# EAGLE design IR_MB (EAGLE 9.2.2)
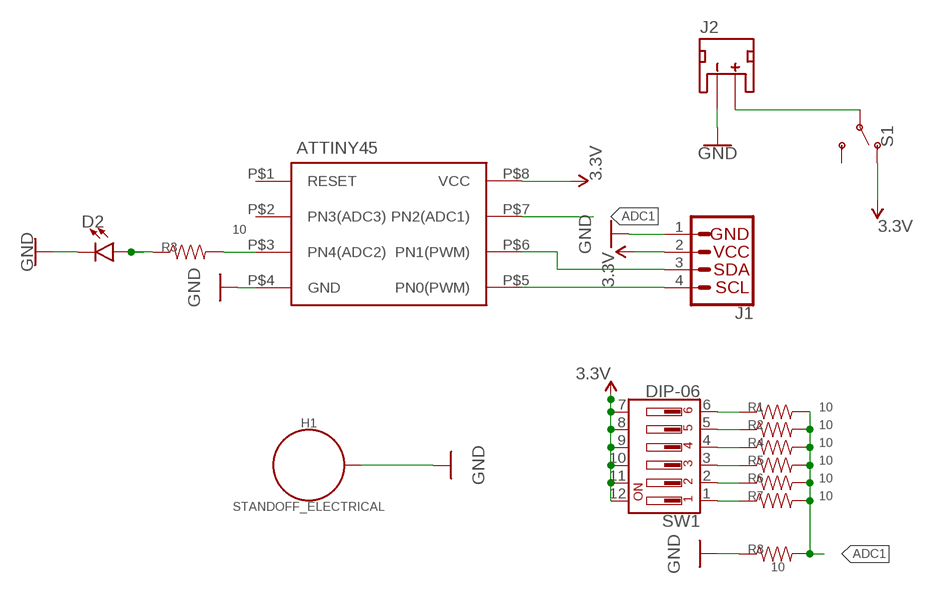
[diagram p0: schematic, sheet 1]

## Parts
D2  LED-FKIT-1206  [FKIT-LED-1206]
H1  STANDOFF_ELECTRICAL  [STANDOFF-ELECTRICAL]
J1  QWIIC_CONNECTORJS-1MM  [1X04_1MM_RA]
J2  JST_2MM_MALE  [JST-2-SMD]
R1  10  10OHM-1206-1/4W-1%  [1206]
R2  10  10OHM-1206-1/4W-1%  [1206]
R3  10  10OHM-1206-1/4W-1%  [1206]
R4  10  10OHM-1206-1/4W-1%  [1206]
R5  10  10OHM-1206-1/4W-1%  [1206]
R6  10  10OHM-1206-1/4W-1%  [1206]
R7  10  10OHM-1206-1/4W-1%  [1206]
R8  10  10OHM-1206-1/4W-1%  [1206]
S1  SWITCH-SPDT-PTH-11.6X4.0MM-KIT  [SWITCH_SPDT_PTH_11.6X4.0MM_KIT]
SW1  DIP-06  [DIPSWITCH-06-SMD]
U$1  ATTINY45  [8PDIP]

## Nets
3.3V [5v]: J1.2 S1.1(O) SW1.7 SW1.8 SW1.9 SW1.10 SW1.11 SW1.12 U$1.P$8(VCC)
ADC1: R1.2 R2.2 R4.2 R5.2 R6.2 R7.2 R8.2 U$1.P$7(PN2(ADC1))
GND: D2.C H1.P1 J1.1 J2.1(-) R8.1 U$1.P$4(GND)
N$1 [5v]: R3.2 U$1.P$3(PN4(ADC2))
N$2: D2.A R3.1
N$3: J1.4 U$1.P$5(PN0(PWM))
N$4: J1.3 U$1.P$6(PN1(PWM))
N$5: J2.2(+) S1.2(P)
N$6: R1.1 SW1.6
N$7: R2.1 SW1.5
N$8: R4.1 SW1.4
N$9: R5.1 SW1.3
N$10: R6.1 SW1.2
N$11: R7.1 SW1.1
Unconnected: J2.NC1(PAD1) J2.NC2(PAD2) S1.3(S) U$1.P$1(RESET) U$1.P$2(PN3(ADC3))

## Library data of the parts
D2 = SparkFun-LED:LED: LED (Generic) Standard schematic elements and footprints for 5mm, 3mm, 1206, and 0603 sized LEDs. Generic LEDs with no color specified.
H1 = IAD-Library:STANDOFF_ELECTRICAL: Stand Off Drill holes with an electrical connection to ground your board to a chassis.
J1 = SparkFun-Connectors:QWIIC_CONNECTOR: SparkFun I2C Standard Qwiic Connector An SMD 1mm pitch JST connector makes it easy and quick (get it? Qwiic?) to connect I2C devices to each other. The Qwiic system <http://www.sparkfun.com/qwiic> enables fast and solderless connection between popular platforms and various sensors and actuators. We carry 200mm <https://www.sparkfun.com/products/14204>, 100mm <https://www.sparkfun.com/products/14205>, 50mm <https://www.sparkfun.com/products/14206>, and breadboard friendly <https://www.sparkfun.com/products/14207> Qwiic cables. We also offer 10 pcs strips <https://www.sparkfun.com/products/14323> the SMD connectors.; PROD_ID: CONN-13694
J2 = SparkFun-Connectors:JST_2MM_MALE: JST 2MM MALE RA CONNECTOR Two pin, compact surface mount connector. Commonly used as a battery input connection point. We really like the solid locking feeling and high current rating on these small connectors. We use these all the time as battery connectors. Mates to single-cell LiPo batteries. Here is the connector we sell at SparkFun: JST Right Angle Connector - White <https://www.sparkfun.com/products/8612> (PRT-08612) Datasheet <http://www.sparkfun.com/datasheets/Prototyping/Connectors/JST-Horizontal.pdf> It was used on these SparkFun products: SparkFun MOSFET Power Controller <https://www.sparkfun.com/products/11214> (PRT-11214) SparkFun Battery Babysitter - LiPo Battery Manager <https://www.sparkfun.com/products/13777> (PRT-13777) And many, many others that required a lipo battery connection.; PROD_ID: CONN-11443; SF_ID: PRT-08612
R1-R8 = SparkFun-Resistors:10OHM: 10Ω resistor A resistor is a passive two-terminal electrical component that implements electrical resistance as a circuit element. Resistors act to reduce current flow, and, at the same time, act to lower voltage levels within circuits. - Wikipedia; PROD_ID: RES-08705
S1 = SparkFun-Switches:SWITCH-SPDT: Single Pole, Double Throw (SPDT) Switch Single-pole, double-throw (SPDT) switch. Variant Overview SMD-AYZ0202 Surface Mount DPDT Switch <https://www.sparkfun.com/products/597> (COM-00597) Used on e.g. LilyPad Arduino USB - ATmega32U4 Board <https://www.sparkfun.com/products/12049> PTH-11.6X4.0MM SPDT Mini Power Switch <https://www.sparkfun.com/products/102> (COM-00102) Used on e.g. SparkFun Simon Says - Through-Hole Soldering Kit <https://www.sparkfun.com/products/10547> (KIT-10547) PTH-11.6X4.0MM-KIT KIT version of SPDT Mini Power Switch - Simplifies soldering by removing tStop of switch pins - only one side can be soldered. PTH-11.6X4.0MM-LOCK LOCK version of SPDT Mini Power Switch - Offset pins hold switch in place for easier soldering. SMD-RIGHT-ANGLE Surface Mount Right Angle Switch <https://www.sparkfun.com/products/10860> (COM-10860) Used on e.g. SparkFun ESP8266 Thing <https://www.sparkfun.com/products/13231>; PROD_ID: SWCH-08261; SF_SKU: COM-00102
SW1 = SparkFun-Switches:DIP-06; PROD_ID: --------
U$1 = IAD-Library:ATTINY45: Attiny 45 or 85

## Net classes
0 default: width 0.4 mm, clearance 0.2 mm
1 5v: width 0.6 mm, clearance 0.2 mm

## Board
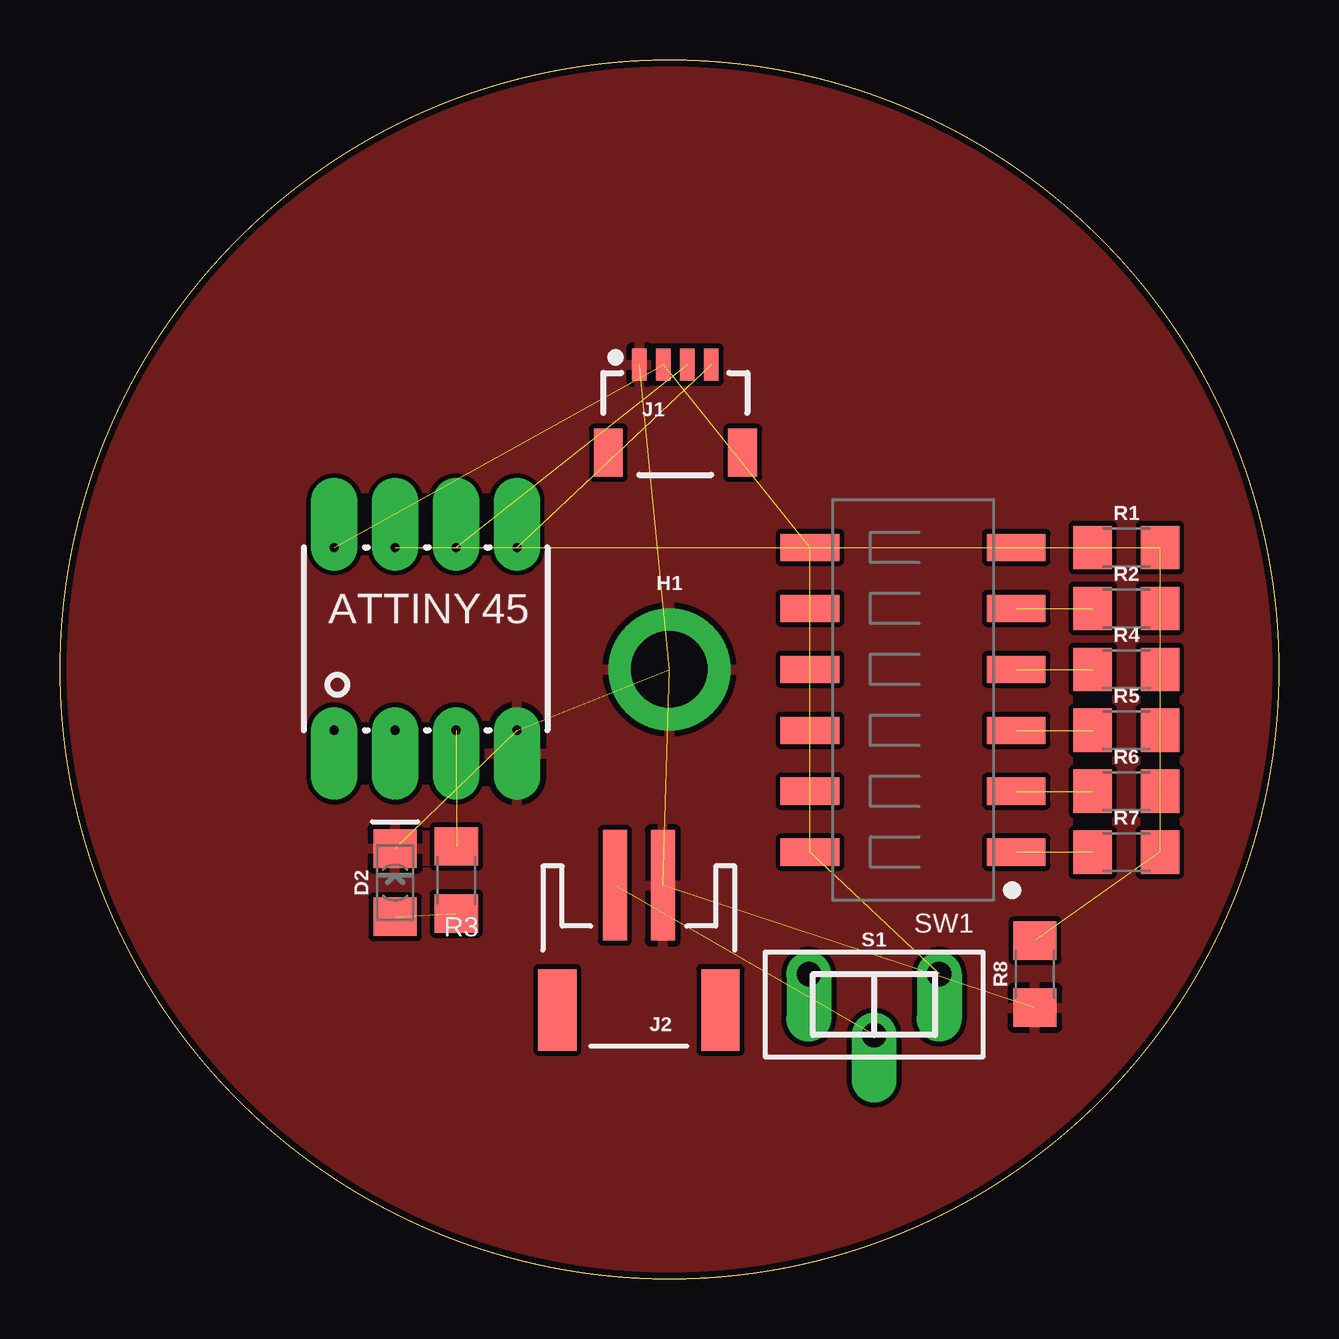
[diagram p1: board, top side]
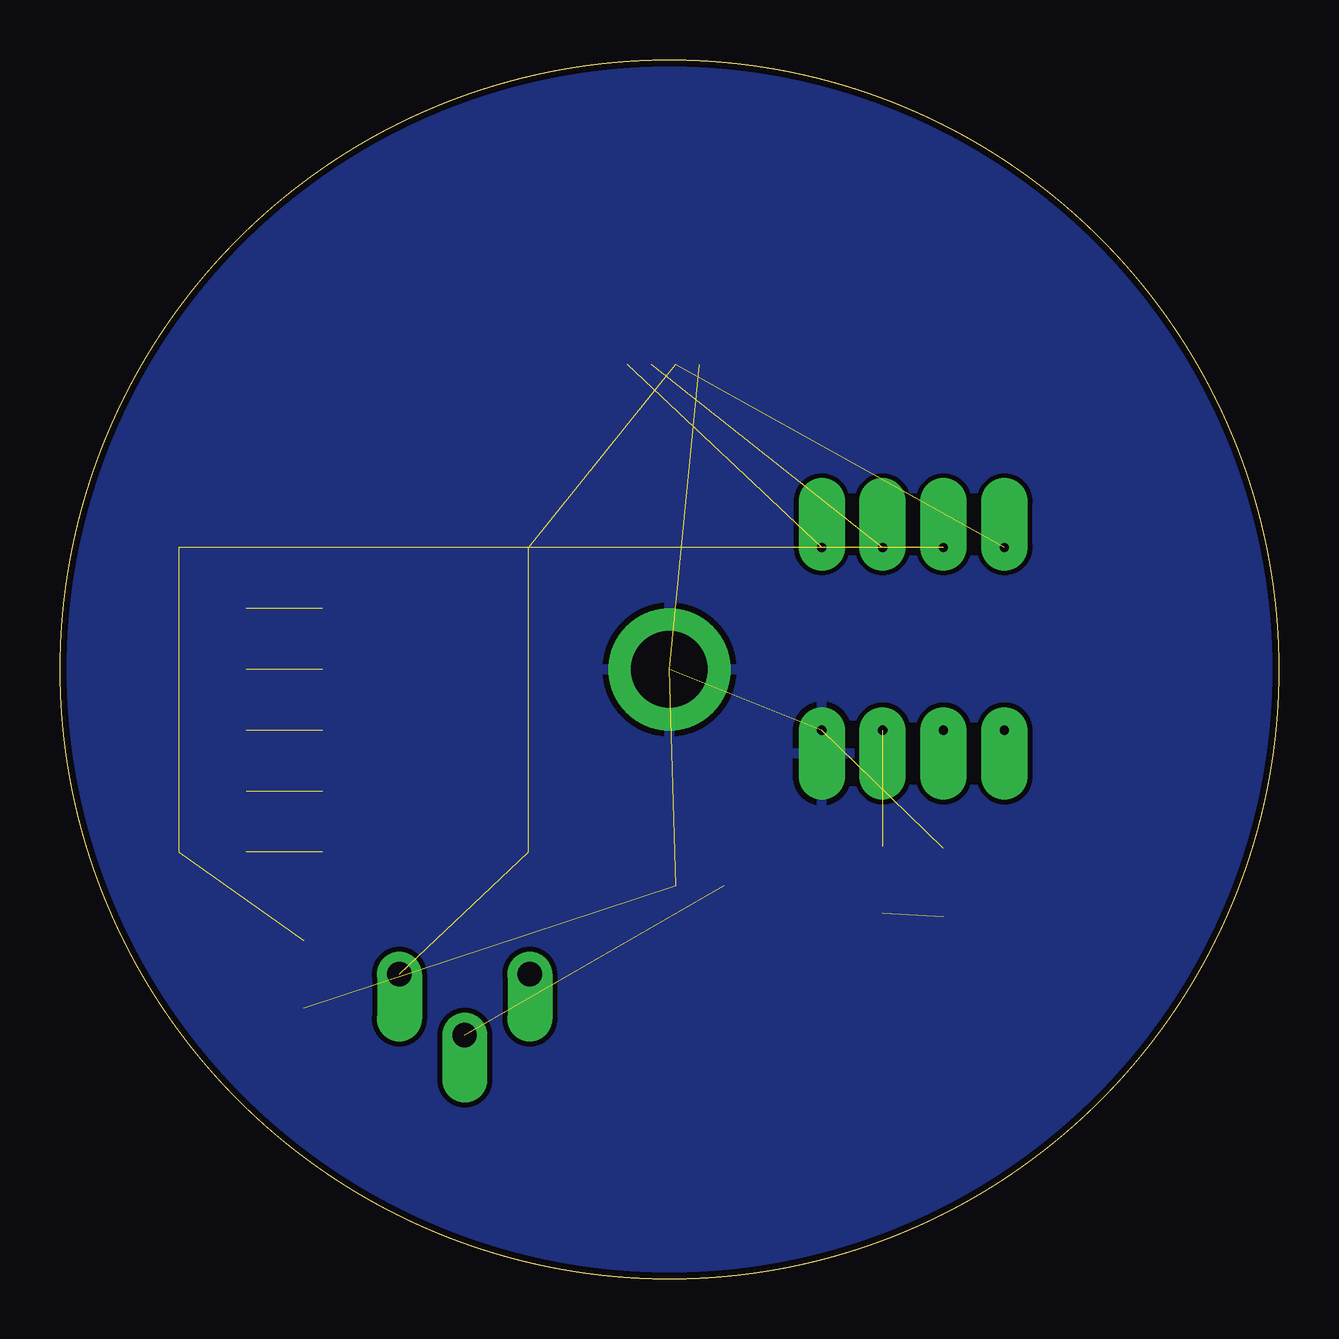
[diagram p2: board, bottom side, seen from below]

Size 50.8 x 50.8 mm. Coordinates in mm from the lower left corner, seen from the top.
Outline: circle at 25.4,25.4 radius 25.4
Copper layers (1*16): Top 0.035mm / dielectric 1.5mm / Bottom 0.035mm
Design rules "SparkFun": minimum track width 8mil, minimum drill 20mil, track to track 8mil, track to pad 8mil, pad to pad 8mil, via to via 8mil, smd to smd 8mil, copper to edge 10mil, drill to drill 8mil, minimum pad ring 12mil, minimum via ring 10mil, stop-mask expansion 4mil, vias tented up to drill 25mil, thermal gap 10mil

### Footprints (pad centres in the part's own frame; a part is rotated, then mirrored left to right if it is on the bottom)
FKIT-LED-1206 = smd 1.6 x 1.803: A -1.422,0; C 1.422,0
STANDOFF-ELECTRICAL = drill 3.2 pad 5.08: P1 0,0
1X04_1MM_RA = smd 0.6 x 1.35: 1 -1.5,0; 2 -0.5,0; 3 0.5,0; 4 1.5,0 | smd 1.2 x 2: NC1 2.8,-3.675; NC2 -2.8,-3.675
JST-2-SMD = smd 1 x 4.6: 1 -1,-3.7; 2 1,-3.7 | smd 1.6 x 3.4: NC1 -3.4,1.5; NC2 3.4,1.5
1206 = smd 1.6 x 1.8: 1 -1.4,0; 2 1.4,0
SWITCH_SPDT_PTH_11.6X4.0MM_KIT = drill 1.016 pad 1.88 offset: 1 -1.27,2.718; 2 1.27,0; 3 -1.27,-2.718
DIPSWITCH-06-SMD = smd 1.13 x 2.44: 1 -6.35,-4.3; 2 -3.81,-4.3; 3 -1.27,-4.3; 4 1.27,-4.3; 5 3.81,-4.3; 6 6.35,-4.3; 7 6.35,4.3; 8 3.81,4.3; 9 1.27,4.3; 10 -1.27,4.3; 11 -3.81,4.3; 12 -6.35,4.3
8PDIP = drill 0.381 pad 1.93 offset: P$1 -3.81,-3.81; P$2 -1.27,-3.81; P$3 1.27,-3.81; P$4 3.81,-3.81; P$5 3.81,3.81; P$6 1.27,3.81; P$7 -1.27,3.81; P$8 -3.81,3.81

### Placement (x,y rotation side)
D2  13.97,16.51 90 top
H1  25.4,25.4 0 top
J1  25.65,38.1 0 top
J2  24.13,12.7 180 top
R1  44.45,30.48 0 top
R2  44.45,27.94 0 top
R3  16.52,16.62 90 top
R4  44.45,25.4 0 top
R5  44.45,22.86 0 top
R6  44.45,20.32 0 top
R7  44.45,17.78 0 top
R8  40.64,12.7 90 top
S1  33.93,11.43 270 top
SW1  35.56,24.13 90 top
U$1  15.24,26.67 0 top

### Tracks (layer width: path | path; a pad name or v marks a point on that pad's centre or on a via)
3.3V  (8 unrouted)
ADC1  (7 unrouted)
GND  (5 unrouted)
  pour Top (isolate 0.1): -11.7,54.12 63.34,54.12 63.34,-4.59 -11.7,-4.59
  pour Bottom (isolate 0.1): -9.43,53.12 62.15,53.12 62.15,-2.05 -9.43,-2.05
N$1  (1 unrouted)
N$2  (1 unrouted)
N$3  (1 unrouted)
N$4  (1 unrouted)
N$5  (1 unrouted)
N$6  (1 unrouted)
N$7  (1 unrouted)
N$8  (1 unrouted)
N$9  (1 unrouted)
N$10  (1 unrouted)
N$11  (1 unrouted)